# Altium schematic sheet STEP_DOWN.SchDoc
size 297 x 209 mm; Engineer: Aleksandr Sereda; Revision: 01_1; SheetNumber: 3; SheetTotal: 11; Email: avsjob000@gmail.com
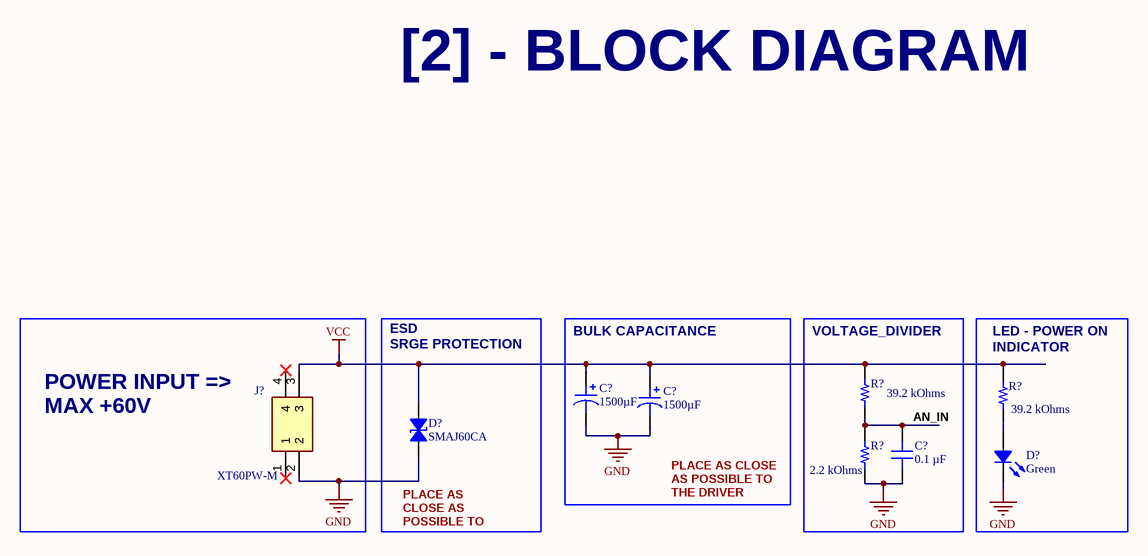
[diagram p0: STEP_DOWN.SchDoc]

## Parts
(Parts that share a designator on the sheet are numbered #1, #2 ... from top to bottom, then left to right.)
C?#1  1500µF  [CAP TH ALUM ELEC D16.00mm S7.50mm H37.00mm]
C?#2  1500µF  [CAP TH ALUM ELEC D16.00mm S7.50mm H37.00mm]
C?#3  0.1 µF  [CAP 0603_1608]
D?#1  SMAJ60CA  [DO214AC SMA]
D?#2  Green  [LED 0603_1608 GREEN]
J?  XT60PW-M  [XT60PWM]
R?#1  39.2 kOhms  [RES 0603_1608]
R?#2  39.2 kOhms  [RES 0603_1608]
R?#3  2.2 kOhms  [RES 0603_1608]

## Blocks framed on the sheet
BULK CAPACITANCE: C?#1 C?#2
VOLTAGE_DIVIDER: C?#3 R?#1 R?#3

## Nets
GND: C?#1.2 C?#2.2 C?#3.1 D?#1.1 D?#2.2 J?.2 R?#3.1
VCC: C?#1.1 C?#2.1 D?#1.2 J?.3 R?#1.2 R?#2.2
AN_IN: C?#3.2 R?#1.1 R?#3.2
NetD?#2_1: D?#2.1 R?#2.1

Not connected (* = marked no-connect by the designer): J? 1* 4*

## Notes on the sheet
- [2] - BLOCK DIAGRAM
- ESD
- SRGE PROTECTION
- (near R?#2) LED - POWER ON
- POWER INPUT =>
- MAX +60V
- (near R?#2) INDICATOR
- (near D?#1) PLACE AS CLOSE AS POSSIBLE TO THE DRIVER MOSFETS
- (near C?#2) PLACE AS CLOSE AS POSSIBLE TO THE DRIVER MOSFETS
- Email:
- Website:
- Designer:
- File:
- Sheet:
- Company:
- Size:
- Title:
- A4
- Altium Designer Professional
- Date:
- Id:
- Rev:
- /

## Library data of the parts
C?#1 C?#2 = 158KXM050M: CAP ALUM 1500UF 20% 50V T/H; manufacturer: Illinois Capacitor; ESR (Equivalent Series Resistance): 132.6mOhm @ 120Hz; Impedance: 71 mOhms; Lifetime @ Temp.: 5000 Hrs @ 105°C; Polarization: Polar; Ripple Current @ High Frequency: 3.01A @ 100kHz; Ripple Current @ Low Frequency: 1.806A @ 120Hz; Part Number: 158KXM050M; Applications: General Purpose; Capacitance: 1500µF; componentlink1description: Datasheet; componentlink1url: http://www.illinoiscapacitor.com/pdf/seriesDocuments/KXM%20series.pdf; componentlink2description: DigiKey Link; componentlink2url: http://digikey.com/product-detail/en/illinois-capacitor/158KXM050M/1572-1681-ND/5411269; Device Package: Radial, Can; Height - Seated (Max): 1.457" (37.00mm); lastupdated: 02.09.2020 01:33:05; Lead Spacing: 0.295" (7.50mm); Lifecycle Status: Active; Minimum Order: 1; Mounting Type: Through Hole; Operating Temperature: -55°C ~ 105°C; Package / Case: Radial, Can; packaging: Bulk; partid: 17669; Part Status: Active; price: 1.83; series: KXM; Size / Dimension: 0.630" Dia (16.00mm); Supplier 1: DigiKey; Supplier Part Number 1: 1572-1681-ND; Tolerance: ±20%; value: 1500µF; Voltage - Rated: 50V
C?#3 = C0603C104K1RACAUTO: CAP CER 0603 0.1UF 100VDC X7R; manufacturer: KEMET; Tolerance: ±10%; Voltage - Rated: 100V; Part Number: C0603C104K1RACAUTO; Capacitance: 0.1 µF; Applications: Automotive, Bypass, Decoupling; componentlink1description: Datasheet; componentlink1url: https://connect.kemet.com:7667/gateway/IntelliData-ComponentDocumentation/1.0/download/datasheet/C0603C104K1RACAUTO; componentlink2description: DigiKey Link; componentlink2url: https://www.digikey.com/en/products/detail/kemet/C0603C104K1RACAUTO/19200789; Device Package: 0603 (1608 Metric); lastupdated: 06.04.2026 19:20:46; Lifecycle Status: Active; Minimum Order: 1; Mounting Type: Surface Mount, MLCC; Operating Temperature: -55°C ~ 125°C; Package / Case: 0603 (1608 Metric); packaging: TapeAndReel; partid: 52392; Part Status: Active; price: 0.04; Ratings: AEC-Q200; series: SMD Auto X7R; Size / Dimension: 0.063" L x 0.031" W (1.60mm x 0.80mm); Supplier 1: DigiKey; Supplier Part Number 1: 399-C0603C104K1RACAUTOCT-ND; Temperature Coefficient: X7R; Thickness (Max): 0.037" (0.95mm); value: 0.1 µF
D?#1 = SMAJ60CA: TVS DIODE 60VWM 96.8VC DO214AC; Manufacturer: Littelfuse Inc.; Bidirectional Channels: 1; Current - Peak Pulse (10/1000µs): 4.1A; Power Line Protection: No; Power - Peak Pulse: 400W; Type: Zener; Voltage - Breakdown (Min): 66.7V; Voltage - Clamping (Max) @ Ipp: 96.8V; Voltage - Reverse Standoff (Typ): 60V; Part Number: SMAJ60CA; Applications: General Purpose; ComponentLink1Description: Datasheet; ComponentLink1URL: https://www.littelfuse.com/~/media/electronics/datasheets/tvs_diodes/littelfuse_tvs_diode_smaj_datasheet.pdf.pdf; ComponentLink2Description: DigiKey Link; ComponentLink2URL: https://www.digikey.com/en/products/detail/littelfuse-inc/SMAJ60CA/762313; LastUpdated: 05.04.2026 21:00:19; Lifecycle Status: Active; Minimum Order: 1; Mounting Type: Surface Mount; Operating Temperature: -65°C ~ 150°C (TJ); Package / Case: DO-214AC, SMA; Packaging: TapeAndReel; PartId: 7372; Part Status: Active; Price: 0.06; Series: SMAJ; Supplier 1: DigiKey; Supplier Part Number 1: SMAJ60CALFCT-ND; Supplier Device Package: DO-214AC (SMA)
D?#2 = QTLP600C4TR: LED GREEN CLEAR SMD; Manufacturer: Everlight Electronics Co Ltd; Configuration: Standard; Current - Test: 20mA; Lens Color: Colorless; Lens Size: 1.20mm x 0.80mm; Lens Style: Rectangle with Flat Top; Millicandela Rating: 18mcd; Viewing Angle: 100°; Voltage - Forward (Vf) (Typ): 2.1V; Wavelength - Dominant: 570nm; Wavelength - Peak: 565nm; Part Number: QTLP600C4TR; Color: Green; ComponentLink1Description: Datasheet; ComponentLink1URL: //media.digikey.com/pdf/Data%20Sheets/Everlight%20PDFs/QTLP600C.pdf; ComponentLink2Description: DigiKey Link; ComponentLink2URL: https://www.digikey.com/en/products/detail/everlight-electronics-co-ltd/QTLP600C4TR/2675890; Device Package: 0603 (1608 Metric); Height (Max): 0.80mm; LastUpdated: 05.04.2026 20:36:38; Lens Transparency: Clear; Lifecycle Status: Active; Minimum Order: 1; Mounting Type: Surface Mount; Package / Case: 0603 (1608 Metric); Packaging: TapeAndReel; PartId: 583; Part Status: Active; Price: 0.06; Series: -; Size / Dimension: 1.60mm L x 0.80mm W; Supplier 1: DigiKey; Supplier Part Number 1: 1080-1399-1-ND; Value: Green
J? = XT60PW-M: Connector; Manufacturer_Name: Changzou Amass Elec; Datasheet Link: https://www.tme.eu/Document/9b8d0c5eb7094295f3d3112c214d3ade/XT60PW%20SPEC.pdf; Height: 8.4mm; Manufacturer_Part_Number: XT60PW-M
R?#1 R?#2 = RC0603FR-1339K2L: RES 39.2K OHM 1% 1/10W 0603; Manufacturer: Yageo; Power (Watts): 0.1W, 1/10W; Temperature Coefficient: ±100ppm/°C; Part Number: RC0603FR-1339K2L; Value: 39.2 kOhms; ComponentLink1Description: Datasheet; ComponentLink1URL: https://www.yageo.com/upload/media/product/products/datasheet/rchip/PYu-RC_Group_51_RoHS_L_12.pdf; ComponentLink2Description: DigiKey Link; ComponentLink2URL: https://www.digikey.com/en/products/detail/yageo/RC0603FR-1339K2L/17009441; Composition: Thick Film; Device Package: 0603 (1608 Metric); Features: Moisture Resistant; Height - Seated (Max): 0.022" (0.55mm); LastUpdated: 06.04.2026 19:43:17; Lifecycle Status: Active; Minimum Order: 1; Number of Terminations: 2; Operating Temperature: -55°C ~ 155°C; Package / Case: 0603 (1608 Metric); Packaging: CutTape; PartId: 87298; Price: 0.01; Resistance: 39.2 kOhms; Series: RC_L; Size / Dimension: 0.063" L x 0.031" W (1.60mm x 0.80mm); Supplier 1: DigiKey; Supplier Part Number 1: 13-RC0603FR-1339K2LCT-ND; Supplier Device Package: 0603; Tolerance: ±1%
R?#3 = RCC06032K20FKEA: RCC0603 100 2K2 1% ET1 E3; Manufacturer: Vishay Dale; Power (Watts): 0.2W, 1/5W; Temperature Coefficient: ±100ppm/°C; Part Number: RCC06032K20FKEA; Value: 2.2 kOhms; ComponentLink1Description: Datasheet; ComponentLink1URL: https://www.vishay.com/docs/20066/rcce3.pdf; ComponentLink2Description: DigiKey Link; ComponentLink2URL: https://www.digikey.com/en/products/detail/vishay-dale/RCC06032K20FKEA/12084206; Composition: Thick Film; Device Package: 0603 (1608 Metric); Features: Automotive AEC-Q200; Height - Seated (Max): 0.020" (0.50mm); LastUpdated: 09.02.2024 20:41:32; Lifecycle Status: Active; Minimum Order: 1; Number of Terminations: 2; Operating Temperature: -55°C ~ 155°C; Package / Case: 0603 (1608 Metric); Packaging: TapeAndReel; PartId: 63163; Part Status: Active; Price: 0.01; Ratings: AEC-Q200; Resistance: 2.2 kOhms; Series: RCC e3; Size / Dimension: 0.061" L x 0.033" W (1.55mm x 0.85mm); Supplier 1: DigiKey; Supplier Part Number 1: 541-RCC06032K20FKEACT-ND; Supplier Device Package: 0603; Tolerance: ±1%